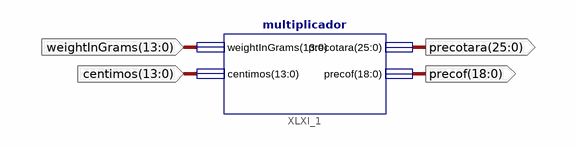
[diagram p0: schematic sheet 1]
// Xilinx ISE schematic multi.sch (artix7) as structural Verilog: 1 symbols, 4 ports
module multi (
  input  [13:0] weightInGrams,
  input  [13:0] centimos,
  output [25:0] precotara,
  output [18:0] precof
);

  multiplicador XLXI_1 (.weightInGrams(weightInGrams), .centimos(centimos), .precotara(precotara), .precof(precof));
endmodule
